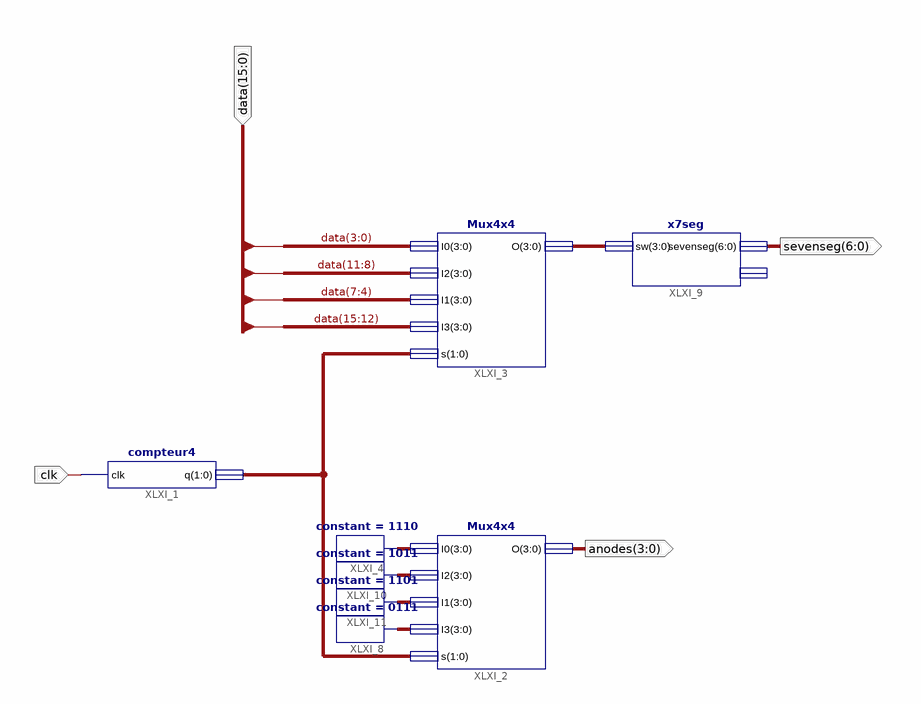
[diagram p0: schematic sheet 1]
// Xilinx ISE schematic afficheur16.sch (spartan3e) as structural Verilog: 8 symbols, 4 ports
module afficheur16 (
  input  clk,
  input  [15:0] data,
  output [3:0] anodes,
  output [6:0] sevenseg
);

  wire [1:0] XLXN_3;
  wire [3:0] XLXN_2, XLXN_6, XLXN_7, XLXN_8, XLXN_13;

  compteur4 XLXI_1 (.clk(clk), .q(XLXN_3));
  Mux4x4 XLXI_2 (.I0(XLXN_2), .I2(XLXN_8), .I1(XLXN_7), .I3(XLXN_6), .s(XLXN_3), .O(anodes));
  Mux4x4 XLXI_3 (.I0(data[3:0]), .I2(data[11:8]), .I1(data[7:4]), .I3(data[15:12]), .s(XLXN_3), .O(XLXN_13));
  constant #(.CValue("1110")) XLXI_4 (.O(XLXN_2));
  constant #(.CValue("0111")) XLXI_8 (.O(XLXN_6));
  x7seg XLXI_9 (.sw(XLXN_13), .sevenseg(sevenseg));  // open: anodes
  constant #(.CValue("1011")) XLXI_10 (.O(XLXN_8));
  constant #(.CValue("1101")) XLXI_11 (.O(XLXN_7));
endmodule
